# Altium schematic sheet Sheet3.SchDoc
size 381 x 241 mm; SheetNumber: 1; SheetTotal: 1
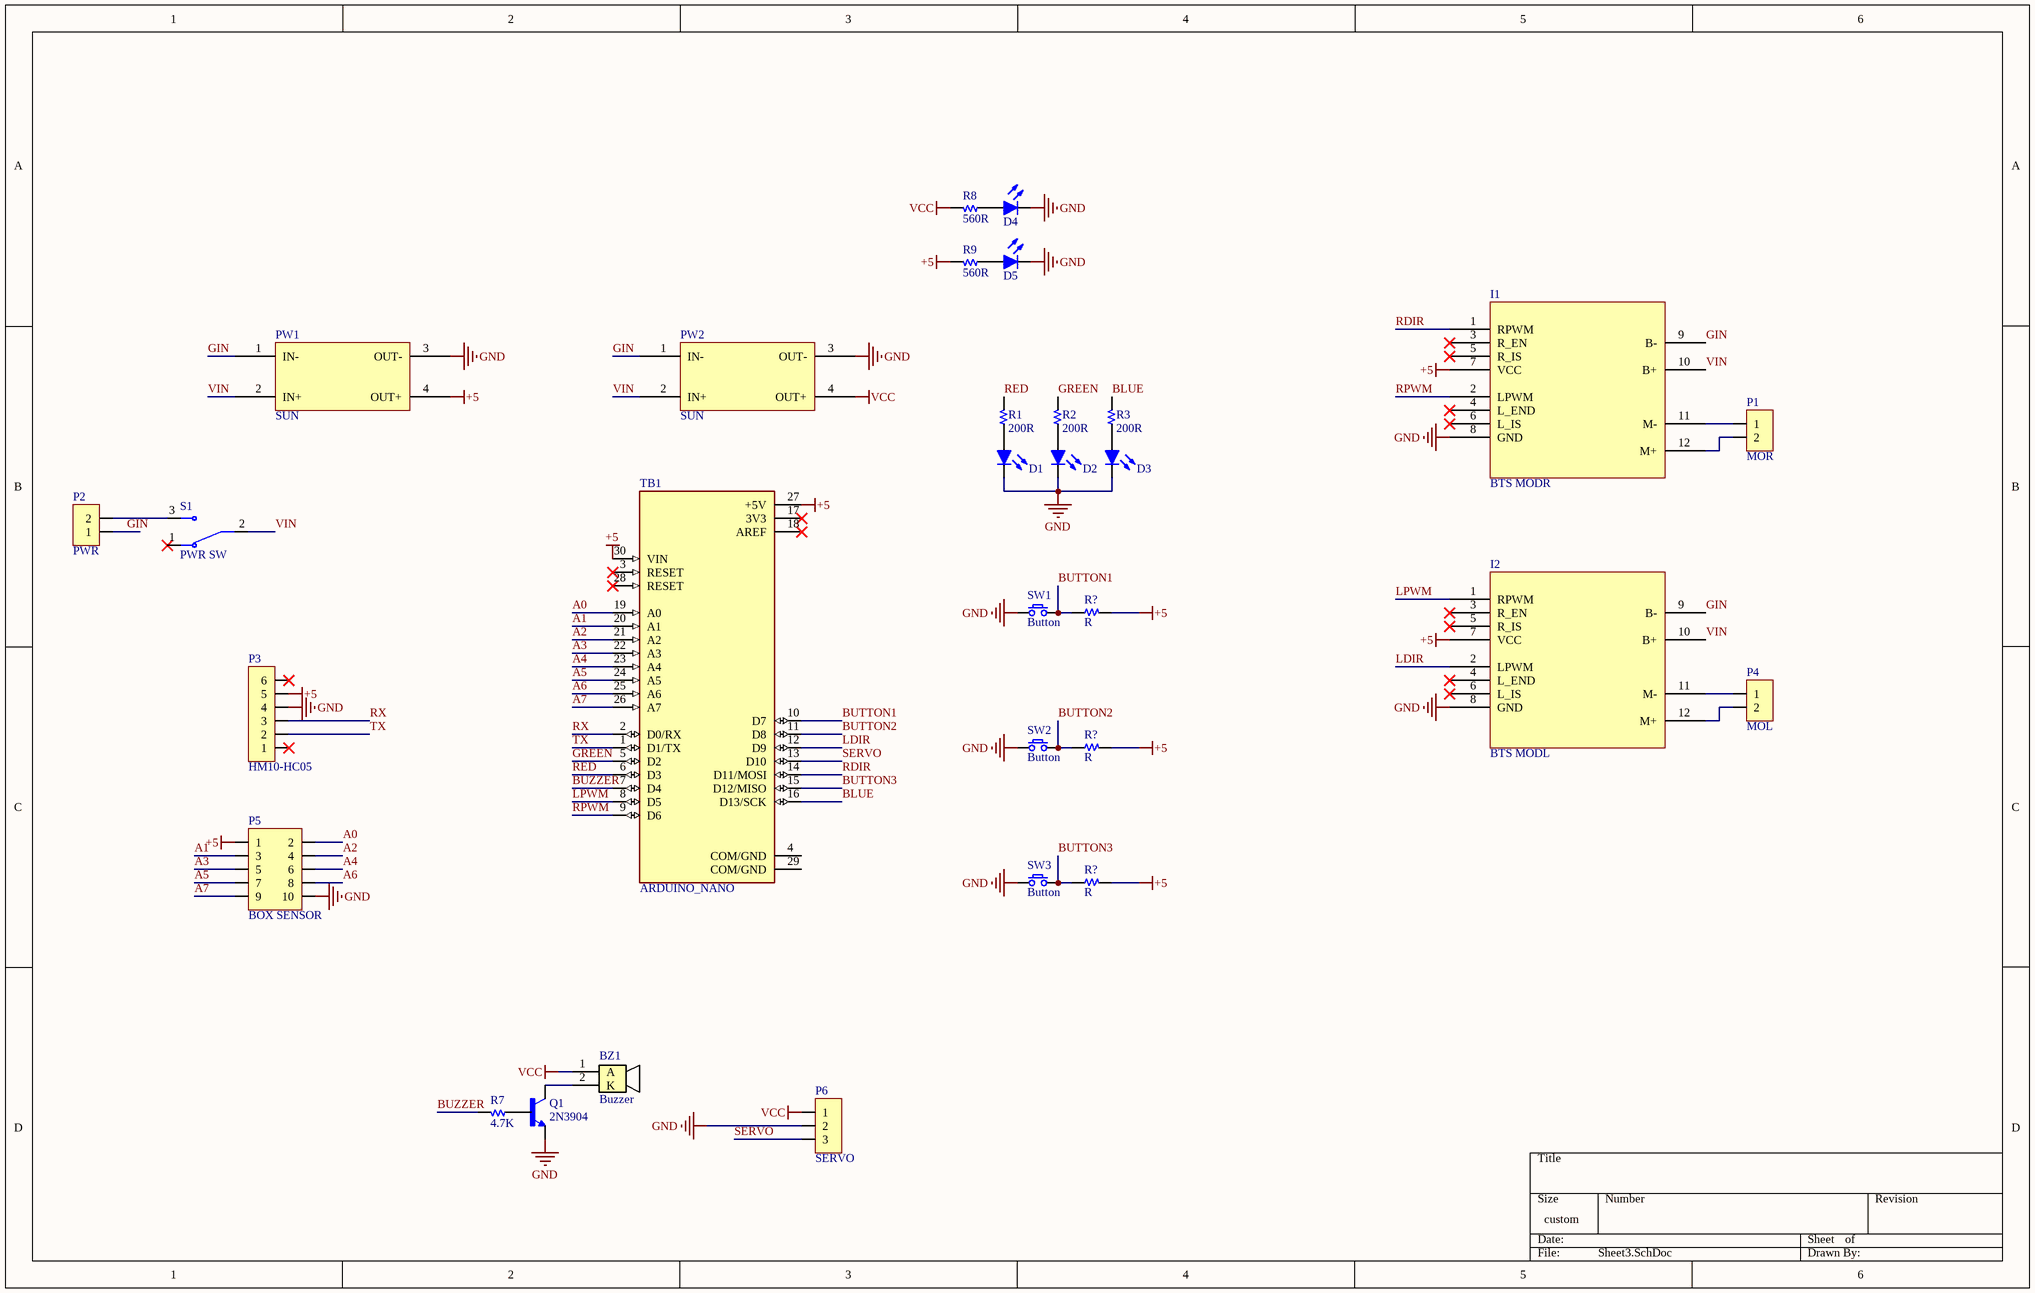
[diagram p0: Sheet3.SchDoc]

## Parts
(Parts that share a designator on the sheet are numbered #1, #2 ... from top to bottom, then left to right.)
BZ1  Buzzer  [BUZZER]
D1  Led  [Led 0805 RED]  (value not drawn)
D2  Led  [Led 0805 Green]  (value not drawn)
D3  Led  [Led 0805 Blue]  (value not drawn)
D4  Led  [Led 0805 Blue]  (value not drawn)
D5  Led  [Led 0805 Blue]  (value not drawn)
I1  BTS MODR  [BTS MOD]
I2  BTS MODL  [BTS MOD]
P1  MOR  [HDR/Terminal/2]
P2  PWR  [HDR/Terminal/2]
P3  HM10-HC05  [HDR/Header/6]
P4  MOL  [HDR/Terminal/2/300]
P5  BOX SENSOR  [HDR/Header/10/DL/BOX]
P6  SERVO  [HDR/Header/3/c1]
PW1  SUN  [DSUN]
PW2  SUN  [DSUN]
Q1  2N3904  [TO92127P495H495-3]
R1  200R  [R 0805]
R2  200R  [R 0805]
R3  200R  [R 0805]
R7  4.7K  [R 0805]
R8  560R  [R 0805]
R9  560R  [R 0805]
R?#1  R  [R 0805]
R?#2  R  [R 0805]
R?#3  R  [R 0805]
S1  PWR SW  [SW_500SSP1S2M2QEA]
SW1  Button  [SW/2/DIP]
SW2  Button  [SW/2/DIP]
SW3  Button  [SW/2/DIP]
TB1  ARDUINO_NANO  [SHIELD_ARDUINO_NANO]

## Nets
+5: I1.7(VCC) I2.7(VCC) P3.5 P5.1 PW1.4(OUT+) R9.2 R?#1.2 R?#2.2 R?#3.2 TB1.27(+5V) TB1.30(VIN)
GND: D1.2(K) D2.2(K) D3.2(K) D4.2(K) D5.2(K) I1.8(GND) I2.8(GND) P3.4 P5.10 P6.2 PW1.3(OUT-) PW2.3(OUT-) Q1.1(E) SW1.1 SW2.1 SW3.1
VCC: BZ1.1(A) P6.1 PW2.4(OUT+) R8.2
A0: P5.2 TB1.19(A0)
A1: P5.3 TB1.20(A1)
A2: P5.4 TB1.21(A2)
A3: P5.5 TB1.22(A3)
A4: P5.6 TB1.23(A4)
A5: P5.7 TB1.24(A5)
A6: P5.8 TB1.25(A6)
A7: P5.9 TB1.26(A7)
BLUE: R3.2 TB1.16(D13/SCK)
BUTTON1: R?#1.1 SW1.2 TB1.10(D7)
BUTTON2: R?#2.1 SW2.2 TB1.11(D8)
BUTTON3: R?#3.1 SW3.2 TB1.15(D12/MISO)
BUZZER: R7.2 TB1.7(D4)
GIN: I1.9(B-) I2.9(B-) P2.1 PW1.1(IN-) PW2.1(IN-)
GREEN: R2.2 TB1.5(D2)
LDIR: I2.2(LPWM) TB1.12(D9)
LPWM: I2.1(RPWM) TB1.8(D5)
RDIR: I1.1(RPWM) TB1.14(D11/MOSI)
RED: R1.2 TB1.6(D3)
RPWM: I1.2(LPWM) TB1.9(D6)
RX: P3.3 TB1.2(D0/RX)
SERVO: P6.3 TB1.13(D10)
TX: P3.2 TB1.1(D1/TX)
VIN: I1.10(B+) I2.10(B+) PW1.2(IN+) PW2.2(IN+) S1.2(COM)
NetBZ1_2: BZ1.2(K) Q1.3(C)
NetD1_1: D1.1(A) R1.1
NetD2_1: D2.1(A) R2.1
NetD3_1: D3.1(A) R3.1
NetD4_1: D4.1(A) R8.1
NetD5_1: D5.1(A) R9.1
NetI1_11: I1.11(M-) P1.1
NetI1_12: I1.12(M+) P1.2
NetI2_11: I2.11(M-) P4.1
NetI2_12: I2.12(M+) P4.2
NetP2_2: P2.2 S1.3(NO)
NetQ1_2: Q1.2(B) R7.1

Not connected (* = marked no-connect by the designer): I1 3(R_EN)* 4(L_END)* 5(R_IS)* 6(L_IS)*; I2 3(R_EN)* 4(L_END)* 5(R_IS)* 6(L_IS)*; P3 1* 6*; S1 1(NC)*; TB1 3(RESET)* 4(COM/GND) 17(3V3)* 18(AREF)* 28(RESET)* 29(COM/GND)

## Library data of the parts
D1-D5 = Led: Typical LED
I1 I2 = BTS MOD
P1 P2 P4 = Header 2: Header, 2-Pin
P3 = Header 6: Header, 6-Pin
P5 = Header 5X2: Header, 5-Pin, Dual row
P6 = Header 3: Header, 3-Pin
PW1 PW2 = a
Q1 = 2N3904: TRANS NPN 40V 200MA TO92-3; MF: Rectron; SnapEDA_Link: https://www.snapeda.com/parts/2N3904/Rectron/view-part/?ref=snap; Package: TO-226-3 Rectron; MP: 2N3904; Check_prices: https://www.snapeda.com/parts/2N3904/Rectron/view-part/?ref=eda; Purchase-URL: https://pricing.snapeda.com/search/part/2N3904/?ref=eda; Price: None; Value: *; Availability: In Stock
R1-R3 R7-R9 R?#1-R?#3 = Resistor
S1 = 500SSP1S2M2QEA: Slide Switch SPDT Through Hole; Package: None; Value: *; Price: None; MP: 500SSP1S2M2QEA; Availability: Unavailable
SW1-SW3 = SW SPST: Tact switch 2 pin
TB1 = ARDUINO_NANO: Small, complete, and breadboard-friendly board based on the ATmega328 (Arduino Nano 3.x); Check_prices: https://www.snapeda.com/parts/Arduino%20Nano/Arduino/view-part/?ref=eda; Value: *; Availability: Not in stock; MP: Arduino Nano; Price: None; Package: Non-Standard Arduino; SnapEDA_Link: https://www.snapeda.com/parts/Arduino%20Nano/Arduino/view-part/?ref=snap; MF: Arduino